# EAGLE design PCB (EAGLE 9.6.2)
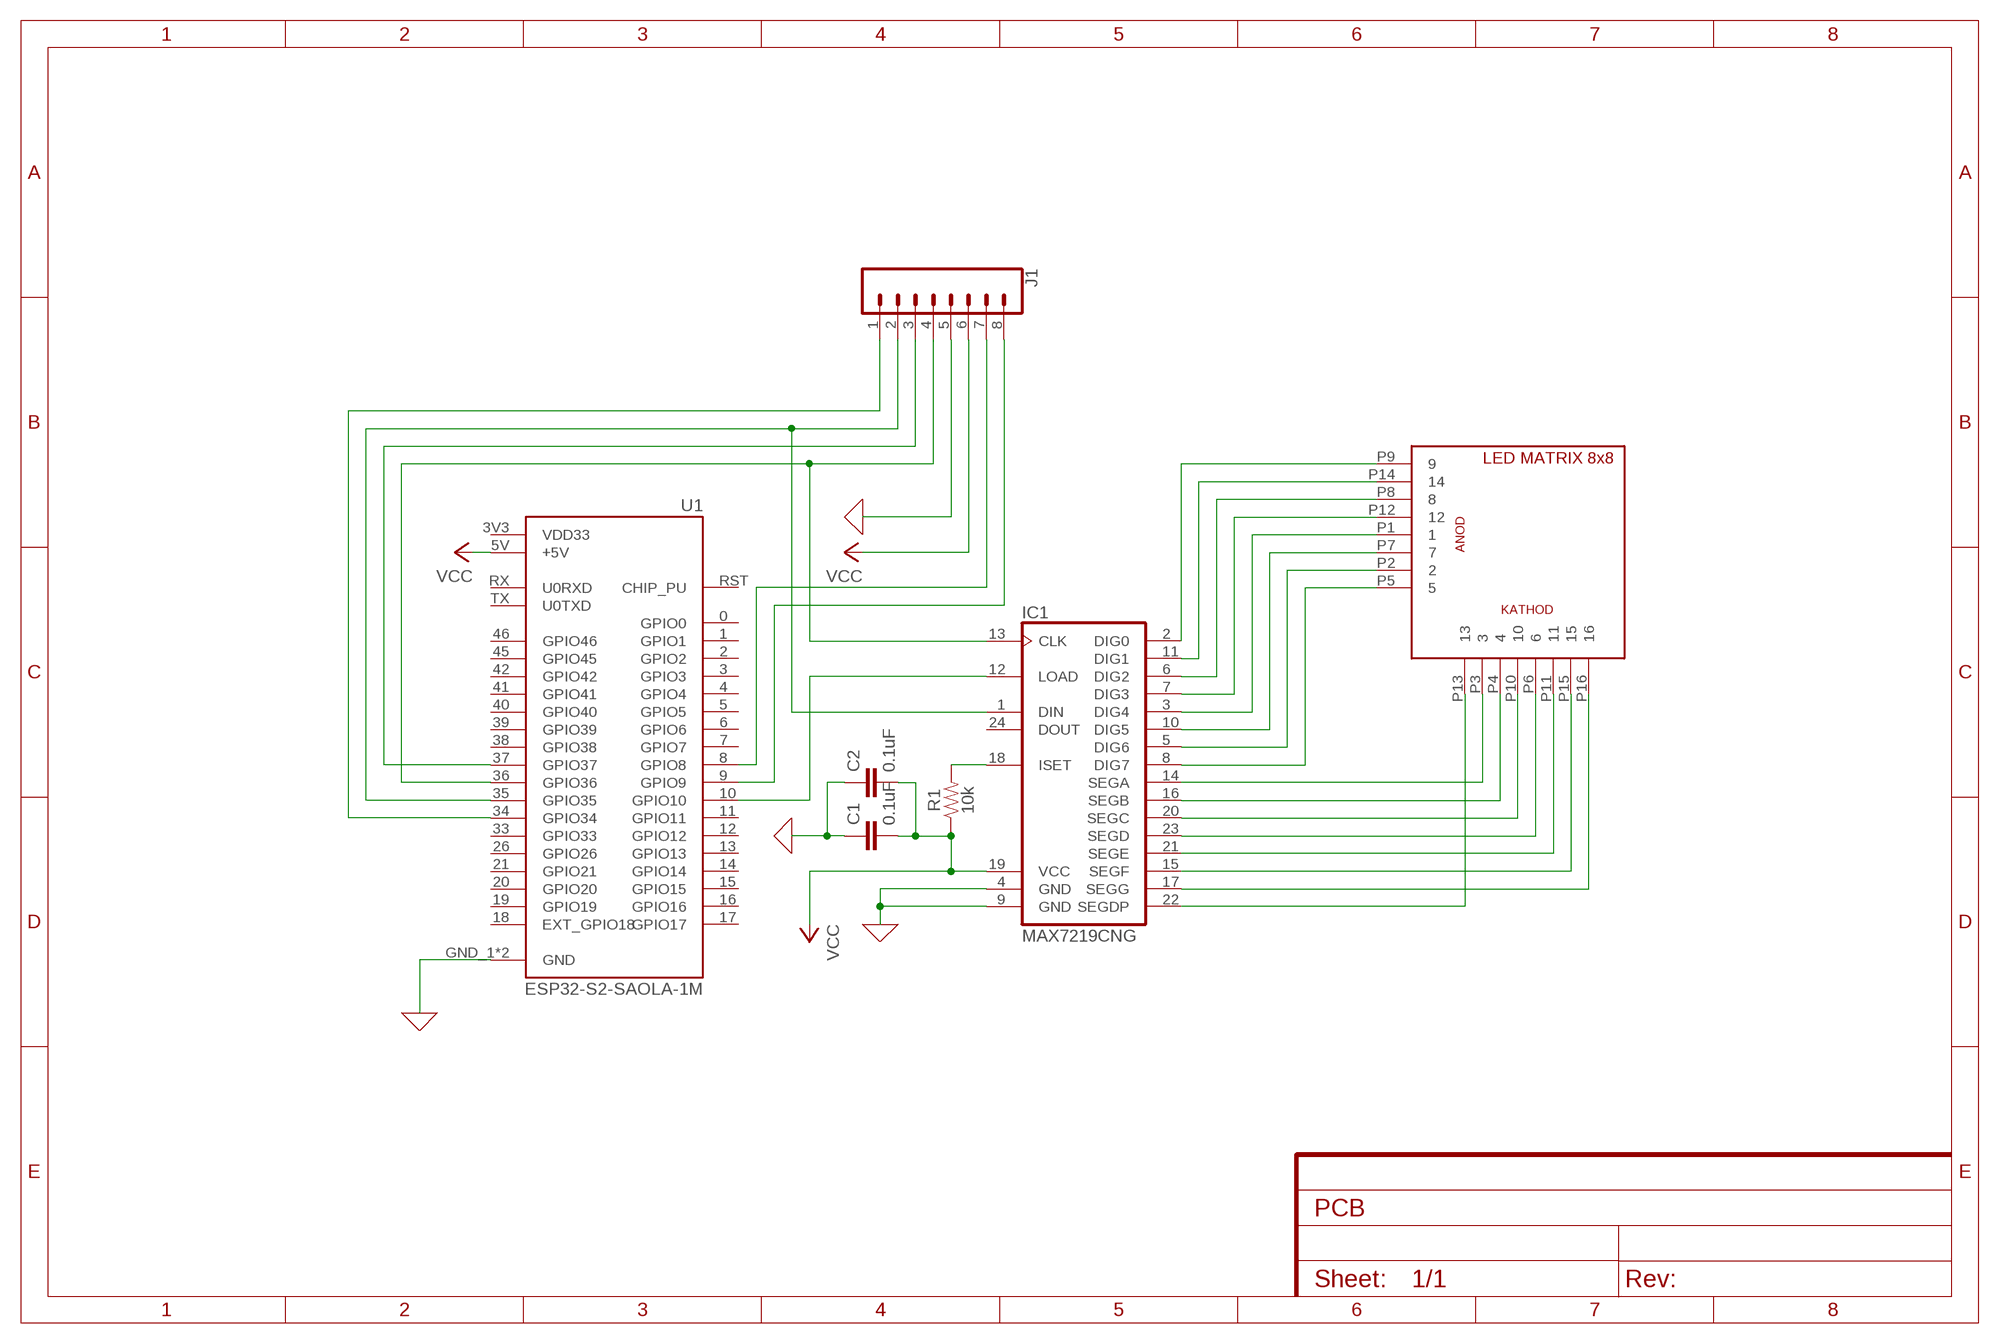
[diagram p0: schematic, sheet 1]

## Parts
C1  0.1uF  0.1UF-KIT-EZ-50V-20%  [CAP-PTH-SMALL-KIT]
C2  0.1uF  0.1UF-KIT-EZ-50V-20%  [CAP-PTH-SMALL-KIT]
IC1  MAX7219CNG  [DIL24-3]
J1  CONN_08"  [1X08]
R1  10k  10KOHM-HORIZ-1/4W-1%  [AXIAL-0.3]
U1  ESP32-S2-SAOLA-1M  [MODULE_ESP32-S2-SAOLA-1M]
U$2  LEDMAT8X8THROUGH_HOLE  [LEDMAT8X8]

## Nets
0: C1.1 C2.1 IC1.4(GND) IC1.9(GND) J1.5 U1.GND_1(GND) U1.GND_2(GND) ; supply symbol labelled GND
N$1: J1.1 U1.34(GPIO34)
N$2: IC1.1(DIN) J1.2 U1.35(GPIO35)
N$3: J1.3 U1.37(GPIO37)
N$4: IC1.13(CLK) J1.4 U1.36(GPIO36)
N$5: J1.7 U1.8(GPIO8)
N$6: IC1.2(DIG0) U$2.P9
N$7: IC1.11(DIG1) U$2.P14
N$8: IC1.6(DIG2) U$2.P8
N$9: IC1.7(DIG3) U$2.P12
N$10: IC1.3(DIG4) U$2.P1
N$11: IC1.10(DIG5) U$2.P7
N$12: IC1.5(DIG6) U$2.P2
N$13: IC1.8(DIG7) U$2.P5
N$14: IC1.22(SEGDP) U$2.P13
N$15: IC1.14(SEGA) U$2.P3
N$16: IC1.16(SEGB) U$2.P4
N$17: IC1.20(SEGC) U$2.P10
N$18: IC1.23(SEGD) U$2.P6
N$19: IC1.21(SEGE) U$2.P11
N$20: IC1.15(SEGF) U$2.P15
N$21: IC1.17(SEGG) U$2.P16
N$22: J1.8 U1.9(GPIO9)
N$23: IC1.18(ISET) R1.P$2
N$24: IC1.12(LOAD) U1.10(GPIO10)
VCC: C1.2 C2.2 IC1.19(VCC) J1.6 R1.P$1 U1.5V(+5V)
Unconnected: IC1.24(DOUT) U1.0(GPIO0) U1.1(GPIO1) U1.2(GPIO2) U1.3(GPIO3) U1.4(GPIO4) U1.5(GPIO5) U1.6(GPIO6) U1.7(GPIO7) U1.11(GPIO11) U1.12(GPIO12) U1.13(GPIO13) U1.14(GPIO14) U1.15(GPIO15) U1.16(GPIO16) U1.17(GPIO17) U1.18(EXT_GPIO18) U1.19(GPIO19) U1.20(GPIO20) U1.21(GPIO21) U1.26(GPIO26) U1.33(GPIO33) U1.38(GPIO38) U1.39(GPIO39) U1.40(GPIO40) U1.41(GPIO41) U1.42(GPIO42) U1.45(GPIO45) U1.46(GPIO46) U1.RST(CHIP_PU) U1.RX(U0RXD) U1.TX(U0TXD)

## Power pins joined to a net without a drawn wire
VDD33: U1.3V3(VDD33)

## Library data of the parts
C1 C2 = SparkFun-Capacitors:0.1UF: 0.1µF ceramic capacitors A capacitor is a passive two-terminal electrical component used to store electrical energy temporarily in an electric field.; PROD_ID: CAP-08370
IC1 = max7219:MAX7219CNG: LED DISPLAY DRIVER; MF: MAXIM; MPN: MAX7219CNG; OC_FARNELL: 1523914; OC_NEWARK: 34C4018
J1 = SparkFun-Connectors:CONN_08: Multi connection point. Often used as Generic Header-pin footprint for 0.1 inch spaced/style header connections On any of the 0.1 inch spaced packages, you can populate with these: Break Away Headers - Straight <https://www.sparkfun.com/products/116> (PRT-00116) Break Away Male Headers - Right Angle <https://www.sparkfun.com/products/553> (PRT-00553) Female Headers <https://www.sparkfun.com/products/115> (PRT-00115) Break Away Headers - Machine Pin <https://www.sparkfun.com/products/117> (PRT-00117) Break Away Female Headers - Swiss Machine Pin <https://www.sparkfun.com/products/743> (PRT-00743) Arduino Stackable Header - 8 Pin <https://www.sparkfun.com/products/9279> (PRT-09279) For SCREWTERMINALS and SPRING TERMINALS visit here: Screw Terimnals on SparkFun.com <https://www.sparkfun.com/search/results?term=Screw+Terminals> (5mm/3.5mm/2.54mm spacing) This device is also useful as a general connection point to wire up your design to another part of your project. Our various solder wires solder well into these plated through hole pads. Hook-Up Wire - Assortment (Stranded, 22 AWG) <https://www.sparkfun.com/products/11375> (PRT-11375) Hook-Up Wire - Assortment (Solid Core, 22 AWG) <https://www.sparkfun.com/products/11367> (PRT-11367) View the entire wire category on our website here <https://www.sparkfun.com/categories/141> Special notes: Molex polarized connector foot print use with SKU : PRT-08231 with associated crimp pins and housings. 1MM SMD Version SKU: PRT-10208 NOTES ON THE VARIANTS LOCK and LOCK_LONGPADS... This footprint was designed to help hold the alignment of a through-hole component (i.e. 6-pin header) while soldering it into place. You may notice that each hole has been shifted either up or down by 0.005 of an inch from it's more standard position (which is a perfectly straight line). This slight alteration caused the pins (the squares in the middle) to touch the edges of the holes. Because they are alternating, it causes a "brace" to hold the component in place. 0.005 has proven to be the perfect amount of "off-center" position when using our standard breakaway headers. Although looks a little odd when you look at the bare footprint, once you have a header in there, the alteration is very hard to notice. Also,if you push a header all the way into place, it is covered up entirely on the bottom side.; PROD_ID: CONN-08438
R1 = SparkFun-Resistors:10KOHM: 10kΩ resistor A resistor is a passive two-terminal electrical component that implements electrical resistance as a circuit element. Resistors act to reduce current flow, and, at the same time, act to lower voltage levels within circuits. - Wikipedia; PROD_ID: RES-12183
U1 = ESP32-S2-SAOLA-1M:ESP32-S2-SAOLA-1M: ESP32 Transceiver; 802.11 b/g/n (Wi-Fi, WiFi, WLAN) For Use With ESP32-S2-WROOM-I Check availability <https://pricing.snapeda.com/parts/ESP32-S2-SAOLA-1M/Espressif%20Systems/view-part?ref=eda>; AVAILABILITY: In Stock; DESCRIPTION: ESP32-S ESP32-S2-WROOM Transceiver; 802.11 b/g/n (Wi-Fi, WiFi, WLAN) 2.4GHz Evaluation Board; MF: Espressif Systems; MP: ESP32-S2-SAOLA-1M; PACKAGE: ESP32 Transceiver Espressif Systems; PRICE: None; PURCHASE-URL: https://pricing.snapeda.com/search/part/ESP32-S2-SAOLA-1M/?ref=eda
U$2 = LEDMAT8x8_BASEL:LEDMAT8X8

## Board
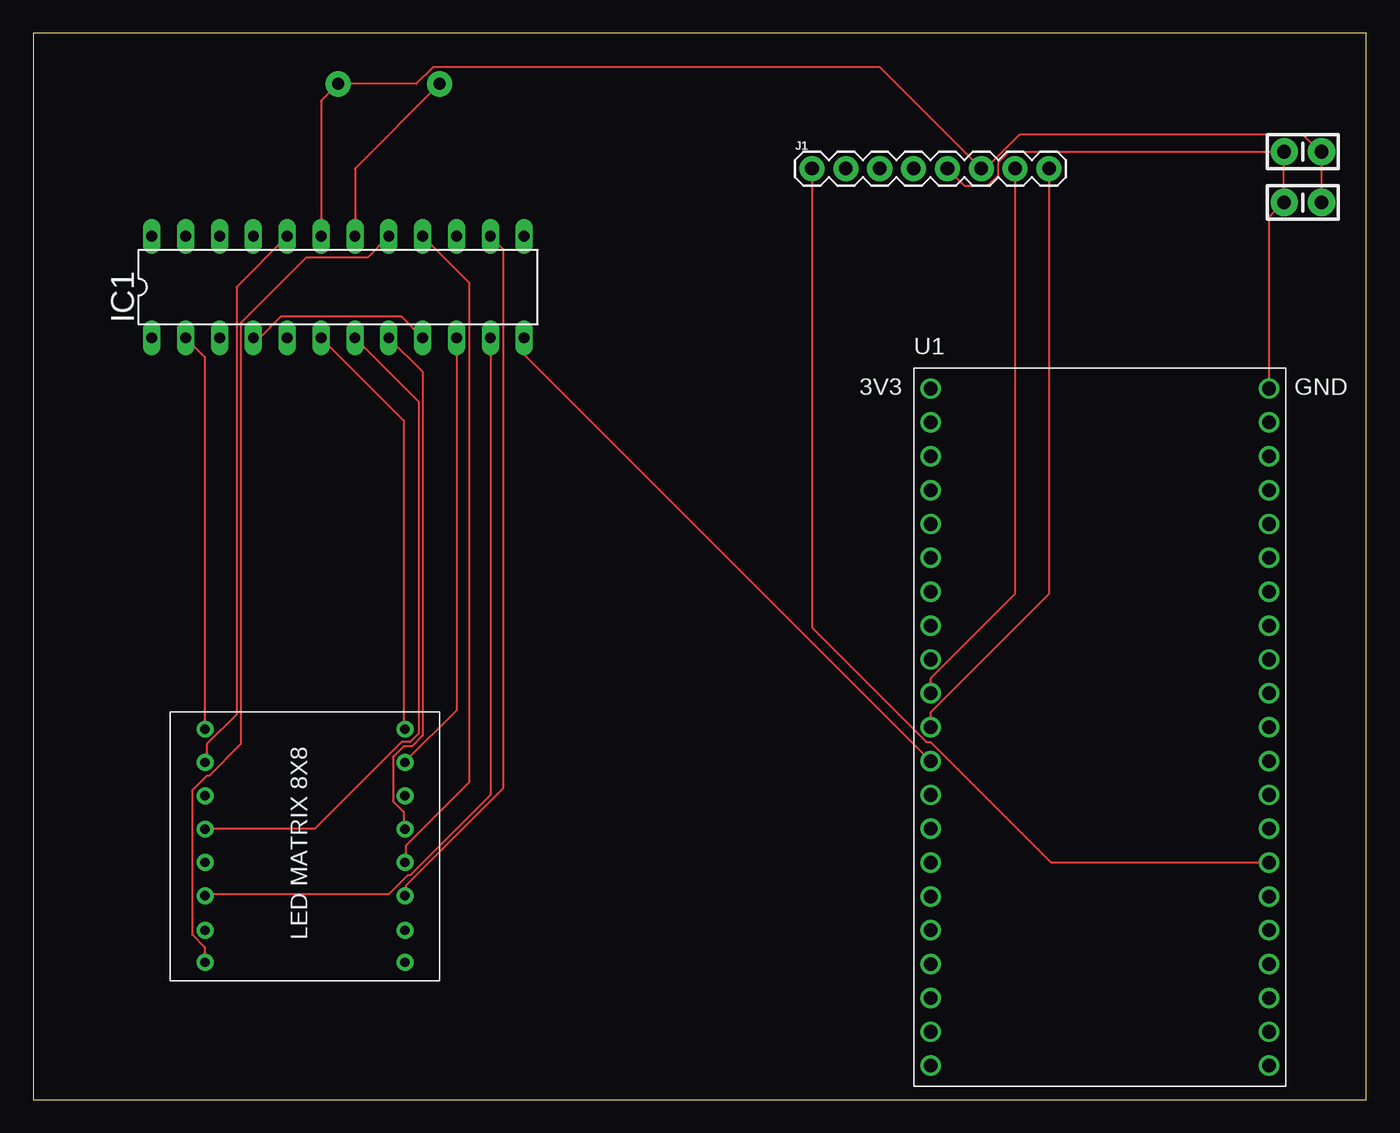
[diagram p1: board, top side]
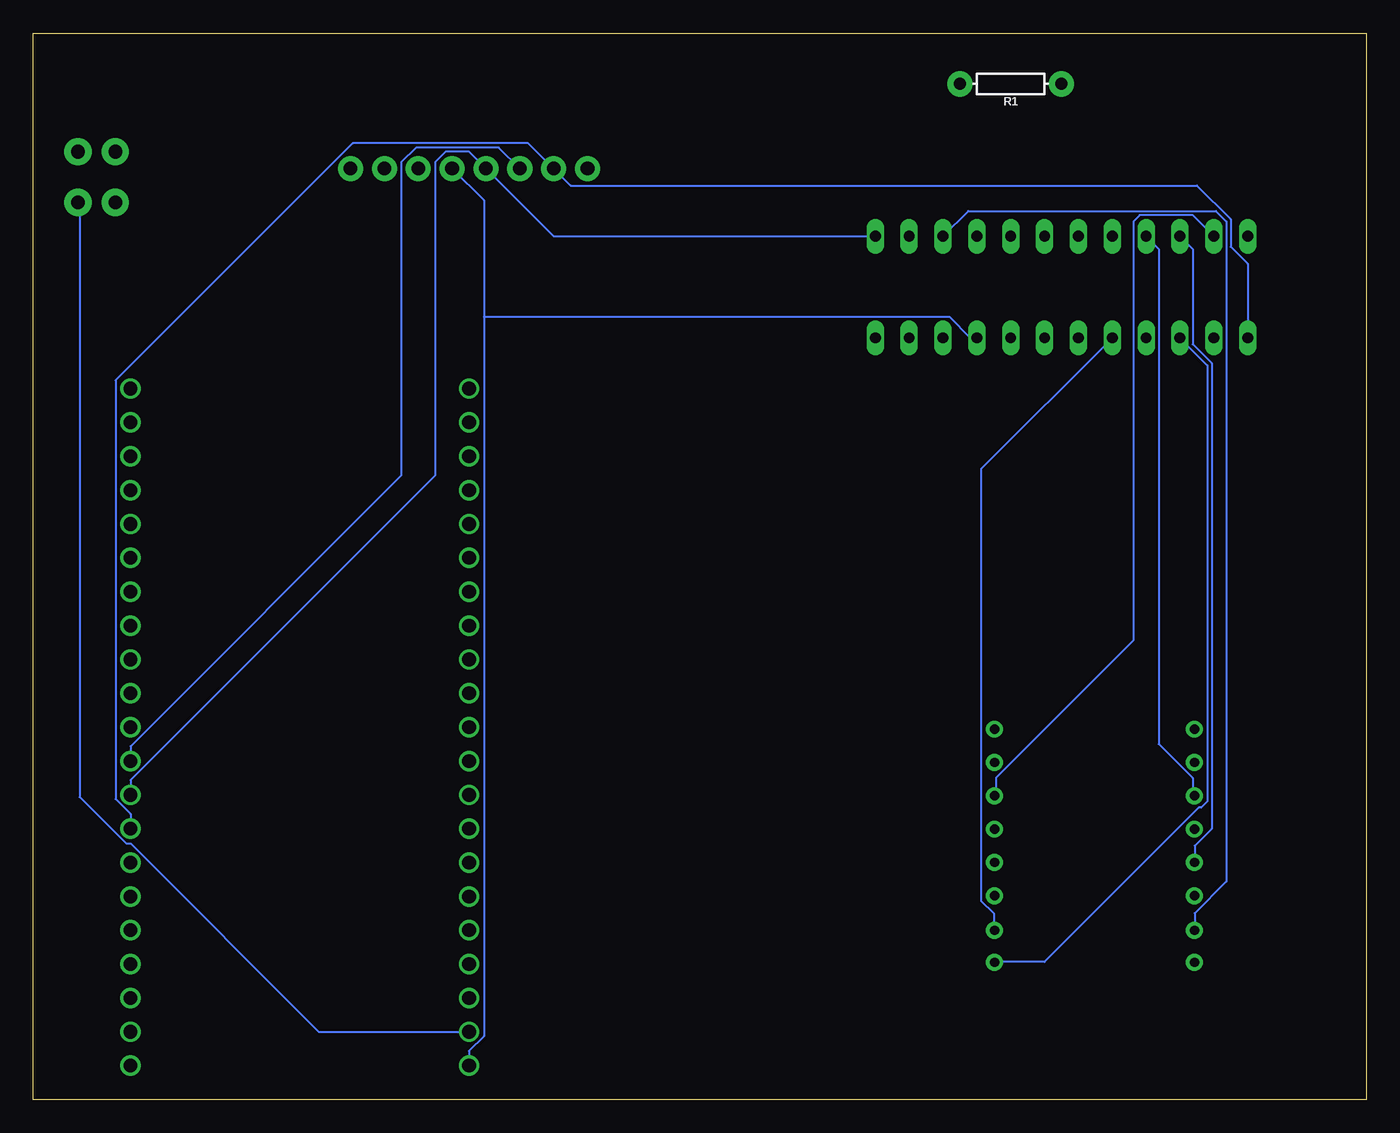
[diagram p2: board, bottom side, seen from below]

Size 100 x 80 mm. Coordinates in mm from the lower left corner, seen from the top.
Outline: 0,0 100,0 100,80 0,80 0,0
Copper layers (1*16): Top 0.035mm / dielectric 1.5mm / Bottom 0.035mm
Design rules "default": minimum track width 6mil, minimum drill 0.35mm, track to track 6mil, track to pad 6mil, pad to pad 6mil, via to via 6mil, smd to smd 6mil, copper to edge 40mil, drill to drill 6mil, minimum pad ring 10mil, minimum via ring 8mil, stop-mask expansion 4mil, vias tented up to drill 0mil, thermal gap 10mil

### Footprints (pad centres in the part's own frame; a part is rotated, then mirrored left to right if it is on the bottom)
CAP-PTH-SMALL-KIT = drill 1.016 pad 2.032: 1 -1.397,0; 2 1.397,0
DIL24-3 = drill 0.813 long: 1 -13.97,-3.81; 2 -11.43,-3.81; 3 -8.89,-3.81; 4 -6.35,-3.81; 5 -3.81,-3.81; 6 -1.27,-3.81; 7 1.27,-3.81; 8 3.81,-3.81; 9 6.35,-3.81; 10 8.89,-3.81; 11 11.43,-3.81; 12 13.97,-3.81; 13 13.97,3.81; 14 11.43,3.81; 15 8.89,3.81; 16 6.35,3.81; 17 3.81,3.81; 18 1.27,3.81; 19 -1.27,3.81; 20 -3.81,3.81; 21 -6.35,3.81; 22 -8.89,3.81; 23 -11.43,3.81; 24 -13.97,3.81
1X08 = drill 1.016 pad 1.88: 1 0,0; 2 2.54,0; 3 5.08,0; 4 7.62,0; 5 10.16,0; 6 12.7,0; 7 15.24,0; 8 17.78,0
AXIAL-0.3 = drill 0.9 pad 1.88: P$1 -3.81,0; P$2 3.81,0
MODULE_ESP32-S2-SAOLA-1M = drill 1.02: 0 -12.7,22.86; 1 -12.7,20.32; 2 -12.7,17.78; 3 -12.7,15.24; 3V3 -12.7,25.4; 4 -12.7,12.7; 5 -12.7,10.16; 5V -12.7,-22.86; 6 -12.7,7.62; 7 -12.7,5.08; 8 -12.7,2.54; 9 -12.7,0; 10 -12.7,-2.54; 11 -12.7,-5.08; 12 -12.7,-7.62; 13 -12.7,-10.16; 14 -12.7,-12.7; 15 -12.7,-15.24; 16 -12.7,-17.78; 17 -12.7,-20.32; 18 12.7,-25.4; 19 12.7,-22.86; 20 12.7,-20.32; 21 12.7,-17.78; 26 12.7,-15.24; 33 12.7,-12.7; 34 12.7,-10.16; 35 12.7,-7.62; 36 12.7,-5.08; 37 12.7,-2.54; 38 12.7,0; 39 12.7,2.54; 40 12.7,5.08; 41 12.7,7.62; 42 12.7,10.16; 45 12.7,17.78; 46 12.7,20.32; GND_1 -12.7,-25.4; GND_2 12.7,25.4; RST 12.7,22.86; RX 12.7,15.24; TX 12.7,12.7
LEDMAT8X8 = drill 0.7 pad 1.27: P1 1.4,2.6; P2 3.8,2.6; P3 6.4,2.6; P4 8.9,2.6; P5 11.4,2.6; P6 13.9,2.6; P7 16.4,2.6; P8 18.9,2.6; P9 18.9,17.6; P10 16.4,17.6; P11 13.9,17.6; P12 11.4,17.6; P13 8.9,17.6; P14 6.4,17.6; P15 3.8,17.6; P16 1.4,17.6

### Placement (x,y rotation side)
C1  95.25,67.31 0 top
C2  95.25,71.12 0 top
IC1  22.86,60.96 0 top
J1  58.42,69.85 0 top
R1  26.67,76.2 180 bottom
U1  80.01,27.94 0 top
U$2  30.48,8.89 90 top

### Tracks (layer width: path | path; a pad name or v marks a point on that pad's centre or on a via)
0
  Top 0.152: U1.GND_2 92.71,66.2 93.82,67.31 | 93.82,67.31 93.82,71.12 | 93.82,67.31 C1.1 | IC1.4 16.99,57.15 18.57,58.74 27.62,58.74 IC1.9 | 93.82,71.12 73.18,71.12 72.39,70.33 72.39,69.37 71.6,68.58 69.85,68.58 J1.5 | 93.82,71.12 C2.1
  Bottom 0.152: U1.GND_1 67.31,3.65 66.2,4.76 66.2,58.74 | 66.2,58.74 66.2,67.47 J1.5 | IC1.9 29.69,57.15 31.27,58.74 66.2,58.74
N$1
  Top 0.152: U1.34 76.36,17.78 67.31,26.83 66.99,26.83 58.42,35.4 J1.1
N$2
  Bottom 0.152: IC1.1 8.89,62.71 10.16,63.98 10.16,66.04 12.7,68.58 59.69,68.58 J1.2 62.87,71.75 76.04,71.75 93.82,53.98 93.82,22.54 92.71,21.43 U1.35
N$3
  Bottom 0.152: U1.37 92.71,26.51 72.39,46.83 72.39,70.33 71.28,71.44 65.09,71.44 J1.3
N$4
  Bottom 0.152: IC1.13 60.96,64.77 J1.4 67.31,71.12 69.06,71.12 69.85,70.33 69.85,46.83 92.71,23.97 U1.36
N$5
  Top 0.152: U1.8 67.31,31.59 73.66,37.94 J1.7
N$6
  Top 0.152: IC1.2 12.86,55.72 12.86,27.94 U$2.P9
N$7
  Top 0.152: IC1.11 34.29,22.86 28.26,16.83 28.1,16.83 26.67,15.4 13.02,15.4 U$2.P14
N$8
  Top 0.152: IC1.6 27.78,50.96 27.78,27.94 U$2.P8
N$9
  Top 0.152: IC1.7 28.89,52.39 28.89,27.46 28.26,26.83 27.62,26.83 21.11,20.32 13.02,20.32 U$2.P12
N$10
  Bottom 0.152: IC1.3 11.91,55.09 11.91,22.38 12.38,21.91 12.54,21.91 24.13,10.32 27.78,10.32 U$2.P1
N$11
  Top 0.152: IC1.10 31.75,29.21 27.94,25.4 U$2.P7
N$12
  Bottom 0.152: IC1.5 28.89,47.31 28.89,14.92 27.94,13.97 27.94,12.7 U$2.P2
N$13
  Top 0.152: IC1.8 29.21,54.61 29.21,27.3 28.42,26.51 27.78,26.51 26.99,25.72 26.99,22.38 27.78,21.59 27.78,20.32 U$2.P5
N$14
  Bottom 0.152: IC1.22 13.02,63.82 13.02,56.67 11.59,55.24 11.59,20.32 12.86,19.05 12.86,17.94 U$2.P13
N$15
  Top 0.152: IC1.14 35.24,63.82 35.24,23.34 27.94,16.03 27.94,15.4 U$2.P3
N$16
  Top 0.152: IC1.16 32.7,61.28 32.7,23.81 27.94,19.05 27.94,17.94 U$2.P4
N$17
  Top 0.152: IC1.20 15.24,60.96 15.24,28.89 13.02,26.67 13.02,25.4 U$2.P10
N$18
  Bottom 0.152: IC1.23 13.02,66.36 16.99,66.36 17.46,65.88 17.46,34.45 27.78,24.13 27.78,22.86 U$2.P6
N$19
  Bottom 0.152: IC1.21 15.56,63.82 15.56,26.67 13.02,24.13 13.02,22.86 U$2.P11
N$20
  Bottom 0.152: IC1.15 29.84,66.67 11.27,66.67 10.48,65.88 10.48,16.35 12.86,13.97 12.86,12.7 U$2.P15
N$21
  Top 0.152: IC1.17 25.08,63.18 20.48,63.18 15.56,58.26 15.56,26.67 13.18,24.29 13.02,24.29 11.91,23.18 11.91,12.38 12.86,11.43 12.86,10.32 U$2.P16
N$22
  Top 0.152: U1.9 67.31,29.05 76.2,37.94 J1.8
N$23
  Top 0.152: IC1.18 24.13,69.85 R1.P$2
N$24
  Top 0.152: IC1.12 36.83,55.88 U1.10
VCC
  Top 0.152: IC1.19 21.59,74.93 R1.P$1 28.73,76.2 30,77.47 63.5,77.47 J1.6 71.44,69.85 73.98,72.39 95.25,72.39 96.52,71.12 C2.2 96.68,71.12 96.68,67.31 C1.2
  Bottom 0.152: U1.5V 78.58,5.08 92.71,19.21 93.03,19.21 96.52,22.7 96.52,67.31 C1.2